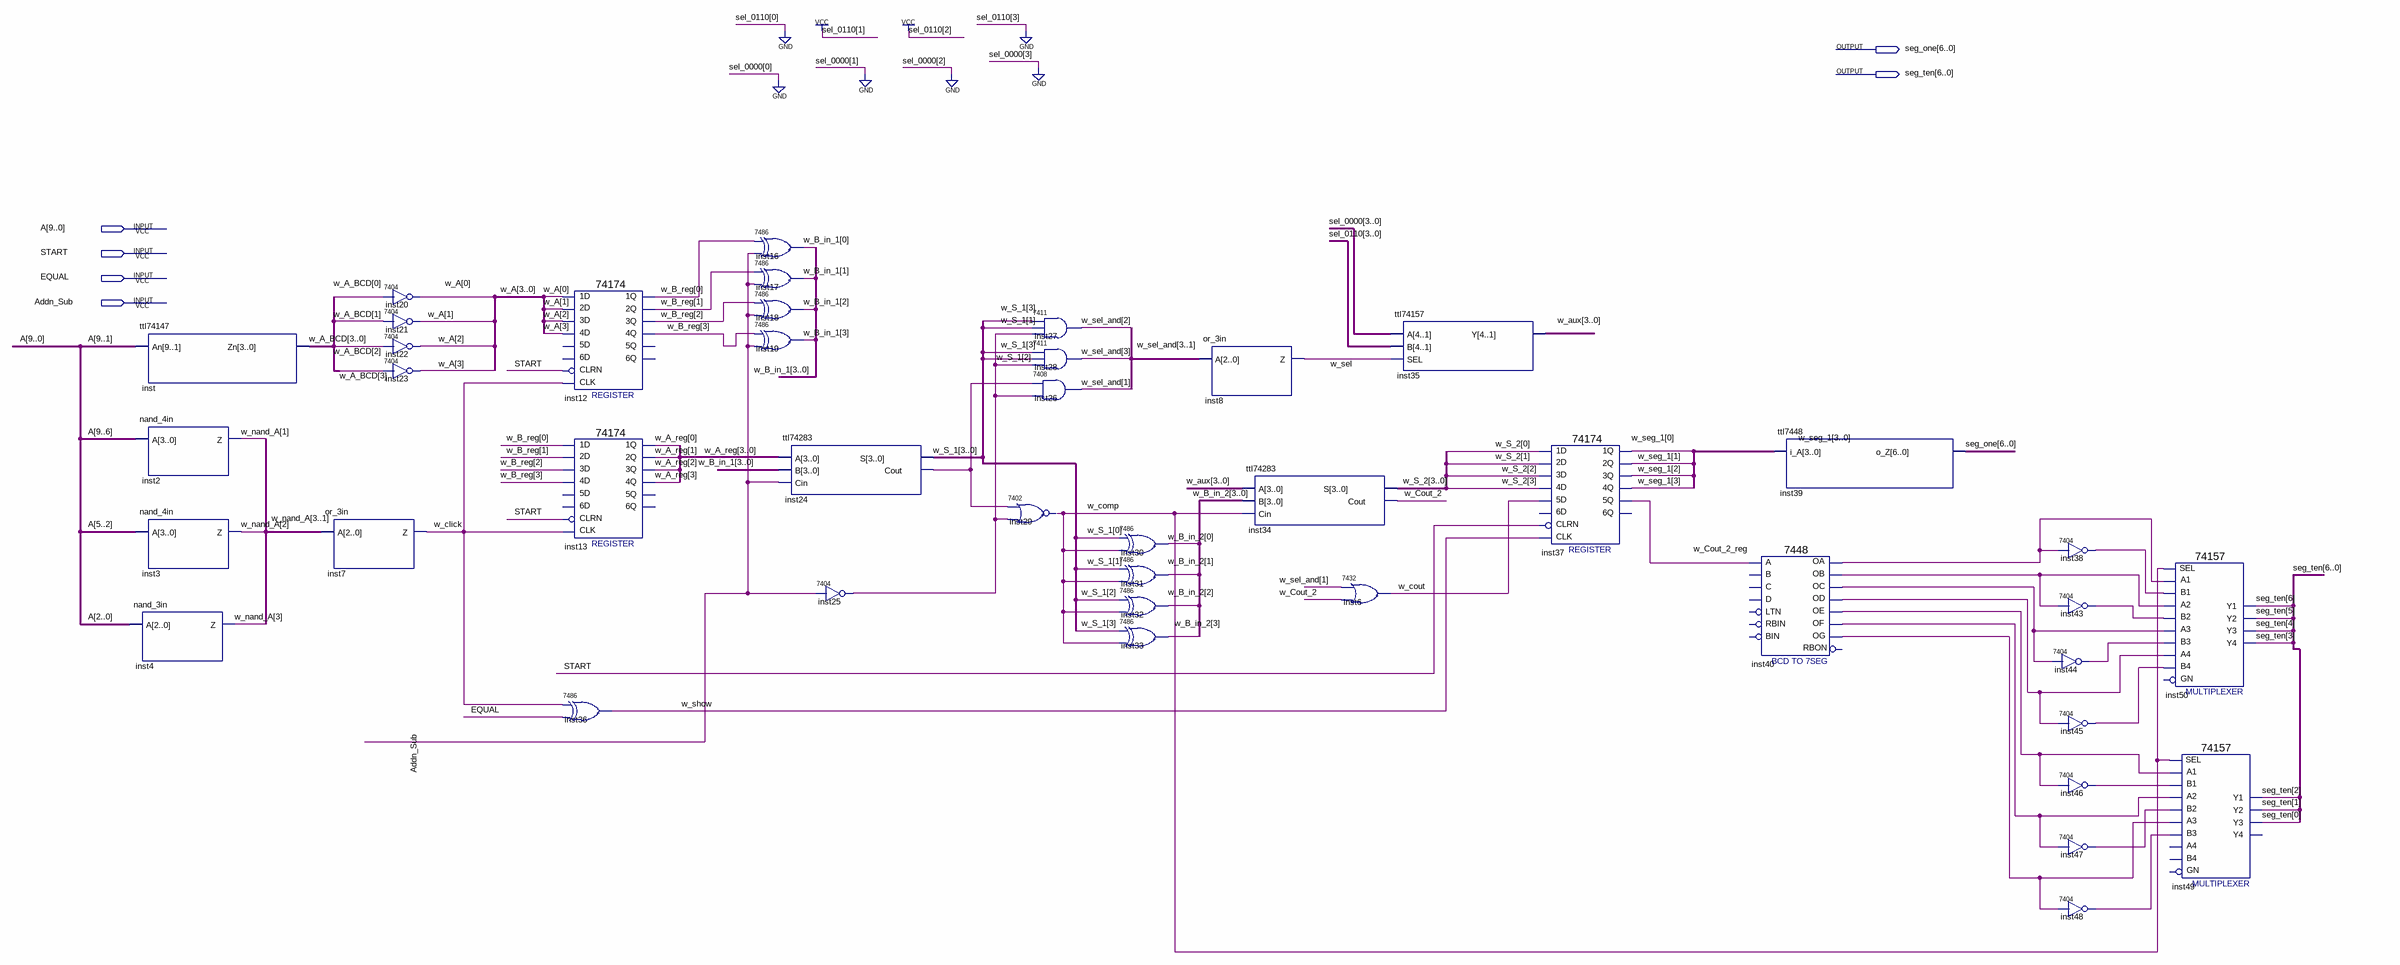
[diagram p0: schematic sheet]
// Quartus schematic top_bdf.bdf as structural Verilog: 42 symbols, 6 pins
module top_bdf (
  input  [9:0] A,
  input  START,
  input  EQUAL,
  input  Addn_Sub,
  output [6:0] seg_one,
  output [6:0] seg_ten
);

  wire inst24_cout, inst25_1, inst38_1, inst40_oa, inst40_ob, inst40_oc, inst40_od, inst40_oe, inst40_of,
       inst40_og, inst43_1, inst44_1, inst45_1, inst46_1, inst47_1, inst48_1, w_click, w_comp, w_cout,
       w_Cout_2, w_Cout_2_reg, w_sel, w_show;
  wire [3:0] w_A, w_A_BCD, w_A_reg, w_aux, w_B_in_1, w_B_in_2, w_B_reg, w_S_1, w_S_2, w_seg_1;
  wire [3:1] w_nand_A, w_sel_and;

  nand_3in inst4 (.A(A[2:0]), .Z(w_nand_A[3]));
  ttl74147 inst (.An(A[9:1]), .Zn(w_A_BCD));
  nand_4in inst2 (.A(A[9:6]), .Z(w_nand_A[1]));
  nand_4in inst3 (.A(A[5:2]), .Z(w_nand_A[2]));
  or_3in inst7 (.A(w_nand_A), .Z(w_click));
  \7404  inst20 (.\2 (w_A_BCD[0]), .\1 (w_A[0]));
  \7404  inst21 (.\2 (w_A_BCD[1]), .\1 (w_A[1]));
  \7404  inst22 (.\2 (w_A_BCD[2]), .\1 (w_A[2]));
  \7404  inst23 (.\2 (w_A_BCD[3]), .\1 (w_A[3]));
  \74174  inst12 (
    .\4D (w_A[3]), .\3D (w_A[2]), .CLK(w_click), .CLRN(START), .\1D (w_A[0]), .\2D (w_A[1]),
    .\1Q (w_B_reg[0]), .\4Q (w_B_reg[3]), .\3Q (w_B_reg[2]), .\2Q (w_B_reg[1]));  // open: 5D, 6D, 6Q, 5Q
  \74174  inst13 (
    .\4D (w_B_reg[3]), .\3D (w_B_reg[2]), .CLK(w_click), .CLRN(START), .\1D (w_B_reg[0]), .\2D (w_B_reg[1]),
    .\1Q (w_A_reg[0]), .\4Q (w_A_reg[3]), .\3Q (w_A_reg[2]), .\2Q (w_A_reg[1]));  // open: 5D, 6D, 6Q, 5Q
  \7486  inst36 (.\2 (w_click), .\3 (EQUAL), .\1 (w_show));
  \7486  inst16 (.\2 (w_B_reg[0]), .\3 (Addn_Sub), .\1 (w_B_in_1[0]));
  \7486  inst17 (.\2 (w_B_reg[1]), .\3 (Addn_Sub), .\1 (w_B_in_1[1]));
  \7486  inst18 (.\2 (w_B_reg[2]), .\3 (Addn_Sub), .\1 (w_B_in_1[2]));
  \7486  inst19 (.\2 (w_B_reg[3]), .\3 (Addn_Sub), .\1 (w_B_in_1[3]));
  ttl74283 inst24 (.A(w_A_reg), .B(w_B_in_1), .Cin(Addn_Sub), .S(w_S_1), .Cout(inst24_cout));
  \7404  inst25 (.\2 (Addn_Sub), .\1 (inst25_1));
  \7402  inst29 (.\2 (inst24_cout), .\3 (inst25_1), .\1 (w_comp));
  \7411  inst27 (.\2 (w_S_1[3]), .\3 (w_S_1[1]), .\4 (inst25_1), .\1 (w_sel_and[2]));
  \7411  inst28 (.\2 (w_S_1[3]), .\3 (w_S_1[2]), .\4 (inst25_1), .\1 (w_sel_and[3]));
  \7408  inst26 (.\3 (inst25_1), .\2 (inst24_cout), .\1 (w_sel_and[1]));
  \7486  inst30 (.\2 (w_S_1[0]), .\3 (w_comp), .\1 (w_B_in_2[0]));
  \7486  inst31 (.\2 (w_S_1[1]), .\3 (w_comp), .\1 (w_B_in_2[1]));
  \7486  inst32 (.\2 (w_S_1[2]), .\3 (w_comp), .\1 (w_B_in_2[2]));
  \7486  inst33 (.\2 (w_S_1[3]), .\3 (w_comp), .\1 (w_B_in_2[3]));
  or_3in inst8 (.A(w_sel_and), .Z(w_sel));
  ttl74283 inst34 (.A(w_aux), .B(w_B_in_2), .Cin(w_comp), .S(w_S_2), .Cout(w_Cout_2));
  \7432  inst6 (.\2 (w_sel_and[1]), .\3 (w_Cout_2), .\1 (w_cout));
  ttl74157 inst35 (.A(4'b0000), .B(4'b0110), .SEL(w_sel), .Y(w_aux));
  \74174  inst37 (
    .\4D (w_S_2[3]), .\3D (w_S_2[2]), .\5D (w_cout), .CLK(w_show), .CLRN(START), .\1D (w_S_2[0]),
    .\2D (w_S_2[1]), .\1Q (w_seg_1[0]), .\4Q (w_seg_1[3]), .\3Q (w_seg_1[2]), .\2Q (w_seg_1[1]),
    .\5Q (w_Cout_2_reg));  // open: 6D, 6Q
  \7448  inst40 (
    .A(w_Cout_2_reg), .OC(inst40_oc), .OE(inst40_oe), .OD(inst40_od), .OF(inst40_of), .OG(inst40_og),
    .OB(inst40_ob), .OA(inst40_oa));  // open: C, D, B, RBIN, BIN, LTN, RBON
  ttl7448 inst39 (.i_A(w_seg_1), .o_Z(seg_one));
  \7404  inst38 (.\2 (inst40_oa), .\1 (inst38_1));
  \7404  inst43 (.\2 (inst40_ob), .\1 (inst43_1));
  \7404  inst44 (.\2 (inst40_oc), .\1 (inst44_1));
  \7404  inst45 (.\2 (inst40_od), .\1 (inst45_1));
  \7404  inst46 (.\2 (inst40_oe), .\1 (inst46_1));
  \7404  inst47 (.\2 (inst40_of), .\1 (inst47_1));
  \7404  inst48 (.\2 (inst40_og), .\1 (inst48_1));
  \74157  inst50 (
    .A1(inst40_oa), .B1(inst38_1), .SEL(w_comp), .B2(inst43_1), .A3(inst40_oc), .B3(inst44_1),
    .A2(inst40_ob), .B4(inst45_1), .A4(inst40_od), .Y2(seg_ten[5]), .Y1(seg_ten[6]), .Y4(seg_ten[3]),
    .Y3(seg_ten[4]));  // open: GN
  \74157  inst49 (
    .A1(inst40_oe), .B1(inst46_1), .SEL(w_comp), .B2(inst47_1), .A3(inst40_og), .B3(inst48_1),
    .A2(inst40_of), .Y2(seg_ten[1]), .Y1(seg_ten[2]), .Y3(seg_ten[0]));  // open: B4, GN, A4, Y4
endmodule
